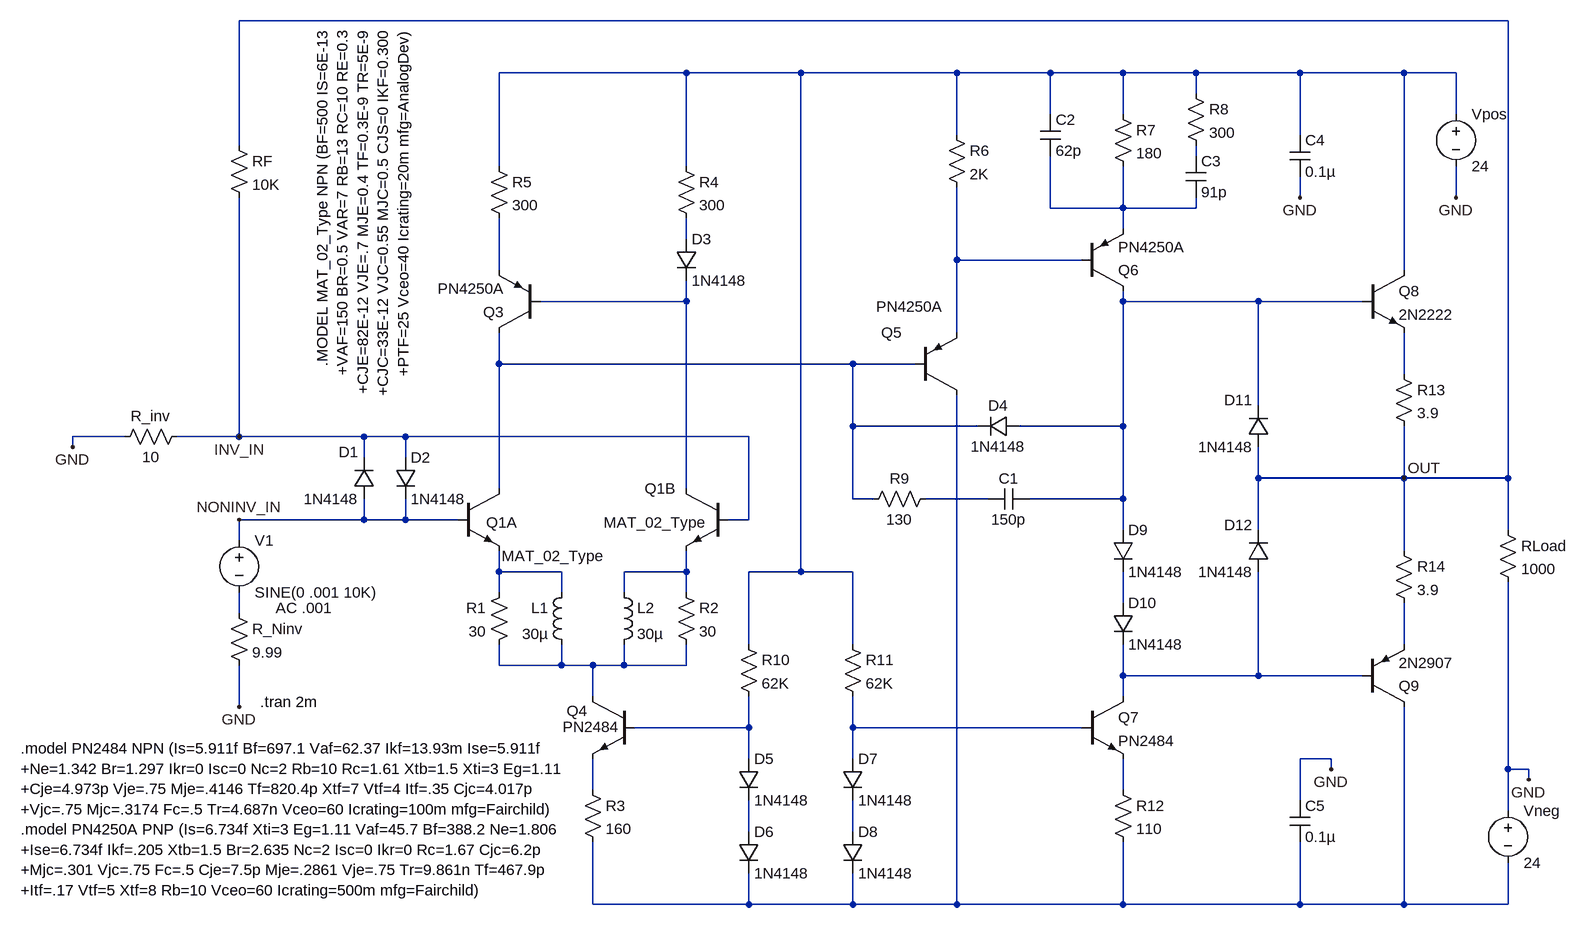
[diagram p0: schematic je990_1.asc]
je990_1.asc, the LTspice schematic file:
Version 4
SHEET 1 4036 2268
WIRE -192 1184 -192 1168
WIRE -112 1168 -192 1168
WIRE 64 720 64 528
WIRE 64 1168 -32 1168
WIRE 64 1168 64 800
WIRE 64 1328 64 1296
WIRE 64 1440 64 1408
WIRE 64 1584 64 1520
WIRE 256 1168 64 1168
WIRE 256 1200 256 1168
WIRE 256 1296 64 1296
WIRE 256 1296 256 1264
WIRE 320 1168 256 1168
WIRE 320 1200 320 1168
WIRE 320 1296 256 1296
WIRE 320 1296 320 1264
WIRE 400 1296 320 1296
WIRE 464 752 464 608
WIRE 464 912 464 832
WIRE 464 1056 464 1008
WIRE 464 1248 464 1056
WIRE 464 1376 464 1344
WIRE 464 1408 464 1376
WIRE 464 1520 464 1488
WIRE 560 1376 464 1376
WIRE 560 1408 560 1376
WIRE 560 1520 464 1520
WIRE 560 1520 560 1488
WIRE 608 1520 560 1520
WIRE 608 1568 608 1520
WIRE 608 1712 608 1664
WIRE 608 1888 608 1792
WIRE 656 1408 656 1376
WIRE 656 1520 608 1520
WIRE 656 1520 656 1488
WIRE 752 608 464 608
WIRE 752 752 752 608
WIRE 752 864 752 832
WIRE 752 960 528 960
WIRE 752 960 752 928
WIRE 752 1248 752 960
WIRE 752 1376 656 1376
WIRE 752 1376 752 1344
WIRE 752 1408 752 1376
WIRE 752 1520 656 1520
WIRE 752 1520 752 1488
WIRE 848 1168 320 1168
WIRE 848 1296 816 1296
WIRE 848 1296 848 1168
WIRE 848 1488 848 1376
WIRE 848 1616 672 1616
WIRE 848 1616 848 1568
WIRE 848 1664 848 1616
WIRE 848 1776 848 1728
WIRE 848 1888 608 1888
WIRE 848 1888 848 1840
WIRE 928 608 752 608
WIRE 928 1376 848 1376
WIRE 928 1376 928 608
WIRE 1008 1056 464 1056
WIRE 1008 1152 1008 1056
WIRE 1008 1264 1008 1152
WIRE 1008 1376 928 1376
WIRE 1008 1488 1008 1376
WIRE 1008 1616 1008 1568
WIRE 1008 1664 1008 1616
WIRE 1008 1776 1008 1728
WIRE 1008 1888 848 1888
WIRE 1008 1888 1008 1840
WIRE 1040 1264 1008 1264
WIRE 1104 1056 1008 1056
WIRE 1168 608 928 608
WIRE 1168 704 1168 608
WIRE 1168 896 1168 784
WIRE 1168 1008 1168 896
WIRE 1168 1888 1008 1888
WIRE 1168 1888 1168 1104
WIRE 1200 1152 1008 1152
WIRE 1216 1264 1120 1264
WIRE 1312 608 1168 608
WIRE 1312 672 1312 608
WIRE 1312 816 1312 736
WIRE 1360 896 1168 896
WIRE 1360 1616 1008 1616
WIRE 1424 608 1312 608
WIRE 1424 672 1424 608
WIRE 1424 816 1312 816
WIRE 1424 816 1424 752
WIRE 1424 848 1424 816
WIRE 1424 960 1424 944
WIRE 1424 1152 1264 1152
WIRE 1424 1152 1424 960
WIRE 1424 1264 1280 1264
WIRE 1424 1264 1424 1152
WIRE 1424 1312 1424 1264
WIRE 1424 1424 1424 1376
WIRE 1424 1536 1424 1488
WIRE 1424 1568 1424 1536
WIRE 1424 1712 1424 1664
WIRE 1424 1888 1168 1888
WIRE 1424 1888 1424 1792
WIRE 1536 608 1424 608
WIRE 1536 640 1536 608
WIRE 1536 736 1536 720
WIRE 1536 816 1424 816
WIRE 1536 816 1536 800
WIRE 1632 960 1424 960
WIRE 1632 1120 1632 960
WIRE 1632 1232 1632 1184
WIRE 1632 1312 1632 1232
WIRE 1632 1536 1424 1536
WIRE 1632 1536 1632 1376
WIRE 1696 608 1536 608
WIRE 1696 704 1696 608
WIRE 1696 800 1696 768
WIRE 1696 1728 1696 1664
WIRE 1696 1888 1424 1888
WIRE 1696 1888 1696 1792
WIRE 1744 1664 1696 1664
WIRE 1744 1680 1744 1664
WIRE 1792 960 1632 960
WIRE 1792 1536 1632 1536
WIRE 1856 608 1696 608
WIRE 1856 912 1856 608
WIRE 1856 1072 1856 1008
WIRE 1856 1232 1632 1232
WIRE 1856 1232 1856 1152
WIRE 1856 1344 1856 1232
WIRE 1856 1488 1856 1424
WIRE 1856 1888 1696 1888
WIRE 1856 1888 1856 1584
WIRE 1936 608 1856 608
WIRE 1936 672 1936 608
WIRE 1936 800 1936 752
WIRE 2016 528 64 528
WIRE 2016 1232 1856 1232
WIRE 2016 1232 2016 528
WIRE 2016 1312 2016 1232
WIRE 2016 1680 2016 1392
WIRE 2016 1744 2016 1680
WIRE 2016 1888 1856 1888
WIRE 2016 1888 2016 1824
WIRE 2048 1680 2016 1680
WIRE 2048 1696 2048 1680
FLAG 64 1168 INV_IN
FLAG 64 1296 NONINV_IN
FLAG 1856 1232 OUT
FLAG 1696 800 GND
FLAG 1744 1680 GND
FLAG 1936 800 GND
FLAG 2048 1696 GND
FLAG 64 1584 GND
FLAG -192 1184 GND
SYMBOL NPN2 400 1248 R0
WINDOW 0 44 52 Left 0
WINDOW 3 68 104 Left 0
SYMATTR InstName Q1A
SYMATTR Value MAT_02_Type
SYMBOL npn2 816 1248 M0
WINDOW 0 80 0 Left 0
WINDOW 3 32 52 Left 0
SYMATTR InstName Q1B
SYMATTR Value MAT_02_Type
SYMBOL npn2 672 1568 M0
WINDOW 0 72 22 Left 0
WINDOW 3 23 47 Left 0
SYMATTR InstName Q4
SYMATTR Value PN2484
SYMBOL npn2 1360 1568 R0
SYMATTR InstName Q7
SYMATTR Value PN2484
SYMBOL ind 640 1392 R0
SYMATTR InstName L2
SYMATTR Value 30µ
SYMBOL ind 576 1392 M0
SYMATTR InstName L1
SYMATTR Value 30µ
SYMBOL RES 736 1392 R0
SYMATTR InstName R2
SYMATTR Value 30
SYMBOL res 480 1392 M0
SYMATTR InstName R1
SYMATTR Value 30
SYMBOL diode 832 1664 R0
SYMATTR InstName D5
SYMATTR Value 1N4148
SYMBOL diode 832 1776 R0
SYMATTR InstName D6
SYMATTR Value 1N4148
SYMBOL res 592 1696 R0
SYMATTR InstName R3
SYMATTR Value 160
SYMBOL diode 304 1200 R0
SYMATTR InstName D2
SYMATTR Value 1N4148
SYMBOL diode 272 1264 R180
WINDOW 0 24 72 Left 0
WINDOW 3 24 0 Left 0
SYMATTR InstName D1
SYMATTR Value 1N4148
SYMBOL res 832 1472 R0
SYMATTR InstName R10
SYMATTR Value 62K
SYMBOL res 992 1472 R0
SYMATTR InstName R11
SYMATTR Value 62K
SYMBOL diode 992 1664 R0
SYMATTR InstName D7
SYMATTR Value 1N4148
SYMBOL diode 992 1776 R0
SYMATTR InstName D8
SYMATTR Value 1N4148
SYMBOL PNP2 528 1008 R180
SYMATTR InstName Q3
SYMATTR Value PN4250A
SYMBOL diode 736 864 R0
SYMATTR InstName D3
SYMATTR Value 1N4148
SYMBOL res 736 736 R0
SYMATTR InstName R4
SYMATTR Value 300
SYMBOL res 448 736 R0
SYMATTR InstName R5
SYMATTR Value 300
SYMBOL res 1408 1696 R0
SYMATTR InstName R12
SYMATTR Value 110
SYMBOL pnp2 1104 1104 M180
WINDOW 0 -52 96 Left 0
WINDOW 3 -60 136 Left 0
SYMATTR InstName Q5
SYMATTR Value PN4250A
SYMBOL res 1152 688 R0
SYMATTR InstName R6
SYMATTR Value 2K
SYMBOL pnp2 1360 944 M180
SYMATTR InstName Q6
SYMATTR Value PN4250A
SYMBOL diode 1408 1312 R0
SYMATTR InstName D9
SYMATTR Value 1N4148
SYMBOL diode 1408 1424 R0
SYMATTR InstName D10
SYMATTR Value 1N4148
SYMBOL cap 1280 1248 R90
WINDOW 0 0 32 VBottom 0
WINDOW 3 32 32 VTop 0
SYMATTR InstName C1
SYMATTR Value 150p
SYMBOL res 1136 1248 R90
WINDOW 0 0 56 VBottom 0
WINDOW 3 32 56 VTop 0
SYMATTR InstName R9
SYMATTR Value 130
SYMBOL diode 1264 1136 R90
WINDOW 0 0 32 VBottom 0
WINDOW 3 32 32 VTop 0
SYMATTR InstName D4
SYMATTR Value 1N4148
SYMBOL res 1408 656 R0
SYMATTR InstName R7
SYMATTR Value 180
SYMBOL res 1520 624 R0
SYMATTR InstName R8
SYMATTR Value 300
SYMBOL cap 1520 736 R0
SYMATTR InstName C3
SYMATTR Value 91p
SYMBOL cap 1296 672 R0
SYMATTR InstName C2
SYMATTR Value 62p
SYMBOL diode 1648 1184 R180
WINDOW 0 24 72 Left 0
WINDOW 3 24 0 Left 0
SYMATTR InstName D11
SYMATTR Value 1N4148
SYMBOL diode 1648 1376 R180
WINDOW 0 24 72 Left 0
WINDOW 3 24 0 Left 0
SYMATTR InstName D12
SYMATTR Value 1N4148
SYMBOL pnp2 1792 1584 M180
SYMATTR InstName Q9
SYMATTR Value 2N2907
SYMBOL res 1840 1328 R0
SYMATTR InstName R14
SYMATTR Value 3.9
SYMBOL res 1840 1056 R0
SYMATTR InstName R13
SYMATTR Value 3.9
SYMBOL npn2 1792 912 R0
SYMATTR InstName Q8
SYMATTR Value 2N2222
SYMBOL cap 1680 704 R0
SYMATTR InstName C4
SYMATTR Value 0.1µ
SYMBOL cap 1680 1728 R0
SYMATTR InstName C5
SYMATTR Value 0.1µ
SYMBOL VOLTAGE 1936 656 R0
SYMATTR InstName Vpos
SYMATTR Value 24
SYMBOL voltage 2016 1728 R0
SYMATTR InstName Vneg
SYMATTR Value 24
SYMBOL res 48 1424 R0
SYMATTR InstName R_Ninv
SYMATTR Value 9.99
SYMBOL res 48 704 R0
SYMATTR InstName RF
SYMATTR Value 10K
SYMBOL res 2000 1296 R0
SYMATTR InstName RLoad
SYMATTR Value 1000
SYMBOL res -16 1152 R90
WINDOW 0 0 56 VBottom 0
WINDOW 3 32 56 VTop 0
SYMATTR InstName R_inv
SYMATTR Value 10
SYMBOL voltage 64 1312 R0
WINDOW 39 0 0 Left 0
WINDOW 123 56 120 Left 0
SYMATTR Value2 AC .001
SYMATTR InstName V1
SYMATTR Value SINE(0 .001 10K)
TEXT 96 1576 Left 0 !.tran 2m
TEXT 192 536 VRight 0 !.MODEL MAT_02_Type NPN (BF=500 IS=6E-13\n+VAF=150 BR=0.5 VAR=7 RB=13 RC=10 RE=0.3\n+CJE=82E-12 VJE=.7 MJE=0.4 TF=0.3E-9 TR=5E-9\n+CJC=33E-12 VJC=0.55 MJC=0.5 CJS=0 IKF=0.300\n+PTF=25 Vceo=40 Icrating=20m mfg=AnalogDev)
TEXT -272 1648 Left 0 !.model PN2484 NPN (Is=5.911f Bf=697.1 Vaf=62.37 Ikf=13.93m Ise=5.911f\n+Ne=1.342 Br=1.297 Ikr=0 Isc=0 Nc=2 Rb=10 Rc=1.61 Xtb=1.5 Xti=3 Eg=1.11\n+Cje=4.973p Vje=.75 Mje=.4146 Tf=820.4p Xtf=7 Vtf=4 Itf=.35 Cjc=4.017p\n+Vjc=.75 Mjc=.3174 Fc=.5 Tr=4.687n Vceo=60 Icrating=100m mfg=Fairchild)\n.model PN4250A PNP (Is=6.734f Xti=3 Eg=1.11 Vaf=45.7 Bf=388.2 Ne=1.806\n+Ise=6.734f Ikf=.205 Xtb=1.5 Br=2.635 Nc=2 Isc=0 Ikr=0 Rc=1.67 Cjc=6.2p\n+Mjc=.301 Vjc=.75 Fc=.5 Cje=7.5p Mje=.2861 Vje=.75 Tr=9.861n Tf=467.9p\n+Itf=.17 Vtf=5 Xtf=8 Rb=10 Vceo=60 Icrating=500m mfg=Fairchild)

The netlist it stands for:
* je990_1.asc
Q1A N004 NONINV_IN N005 0 MAT_02_Type
Q1B N011 INV_IN N009 0 MAT_02_Type
Q4 N006 N012 N007 0 PN2484
Q7 N021 N014 N022 0 PN2484
L2 N009 N006 30µ
L1 N005 N006 30µ
R2 N009 N006 30
R1 N005 N006 30
D5 N012 N013 1N4148
D6 N013 N008 1N4148
R3 N007 N008 160
D2 INV_IN NONINV_IN 1N4148
D1 NONINV_IN INV_IN 1N4148
R10 N002 N012 62K
R11 N002 N014 62K
D7 N014 N015 1N4148
D8 N015 N008 1N4148
Q3 N004 N011 N003 0 PN4250A
D3 N010 N011 1N4148
R4 N002 N010 300
R5 N002 N003 300
R12 N022 N008 110
Q5 N008 N004 N016 0 PN4250A
R6 N002 N016 2K
Q6 N019 N016 N018 0 PN4250A
D9 N019 N020 1N4148
D10 N020 N021 1N4148
C1 N019 N017 150p
R9 N017 N004 130
D4 N019 N004 1N4148
R7 N002 N018 180
R8 N002 N023 300
C3 N023 N018 91p
C2 N002 N018 62p
D11 OUT N019 1N4148
D12 N021 OUT 1N4148
Q9 N008 N021 N025 0 2N2907
R14 OUT N025 3.9
R13 N024 OUT 3.9
Q8 N002 N019 N024 0 2N2222
C4 N002 GND 0.1µ
C5 GND N008 0.1µ
Vpos N002 GND 24
Vneg GND N008 24
R_Ninv N001 GND 9.99
RF OUT INV_IN 10K
RLoad OUT GND 1000
R_inv INV_IN GND 10
V1 NONINV_IN N001 SINE(0 .001 10K) AC .001
.model D D
.lib standard.dio
.model NPN NPN
.model PNP PNP
.lib standard.bjt
.tran 2m
.MODEL MAT_02_Type NPN (BF=500 IS=6E-13
+VAF=150 BR=0.5 VAR=7 RB=13 RC=10 RE=0.3
+CJE=82E-12 VJE=.7 MJE=0.4 TF=0.3E-9 TR=5E-9
+CJC=33E-12 VJC=0.55 MJC=0.5 CJS=0 IKF=0.300
+PTF=25 Vceo=40 Icrating=20m mfg=AnalogDev)
.model PN2484 NPN (Is=5.911f Bf=697.1 Vaf=62.37 Ikf=13.93m Ise=5.911f
+Ne=1.342 Br=1.297 Ikr=0 Isc=0 Nc=2 Rb=10 Rc=1.61 Xtb=1.5 Xti=3 Eg=1.11
+Cje=4.973p Vje=.75 Mje=.4146 Tf=820.4p Xtf=7 Vtf=4 Itf=.35 Cjc=4.017p
+Vjc=.75 Mjc=.3174 Fc=.5 Tr=4.687n Vceo=60 Icrating=100m mfg=Fairchild)
.model PN4250A PNP (Is=6.734f Xti=3 Eg=1.11 Vaf=45.7 Bf=388.2 Ne=1.806
+Ise=6.734f Ikf=.205 Xtb=1.5 Br=2.635 Nc=2 Isc=0 Ikr=0 Rc=1.67 Cjc=6.2p
+Mjc=.301 Vjc=.75 Fc=.5 Cje=7.5p Mje=.2861 Vje=.75 Tr=9.861n Tf=467.9p
+Itf=.17 Vtf=5 Xtf=8 Rb=10 Vceo=60 Icrating=500m mfg=Fairchild)
.backanno
.end